# EasyEDA schematic SCH_webLed_2024-11-11.json
TITLE: Sheet_1; REV: 1.0; Date: 2024-10-29; Sheet: 1/1; Drawn By: crashtester19; Company: Your Company
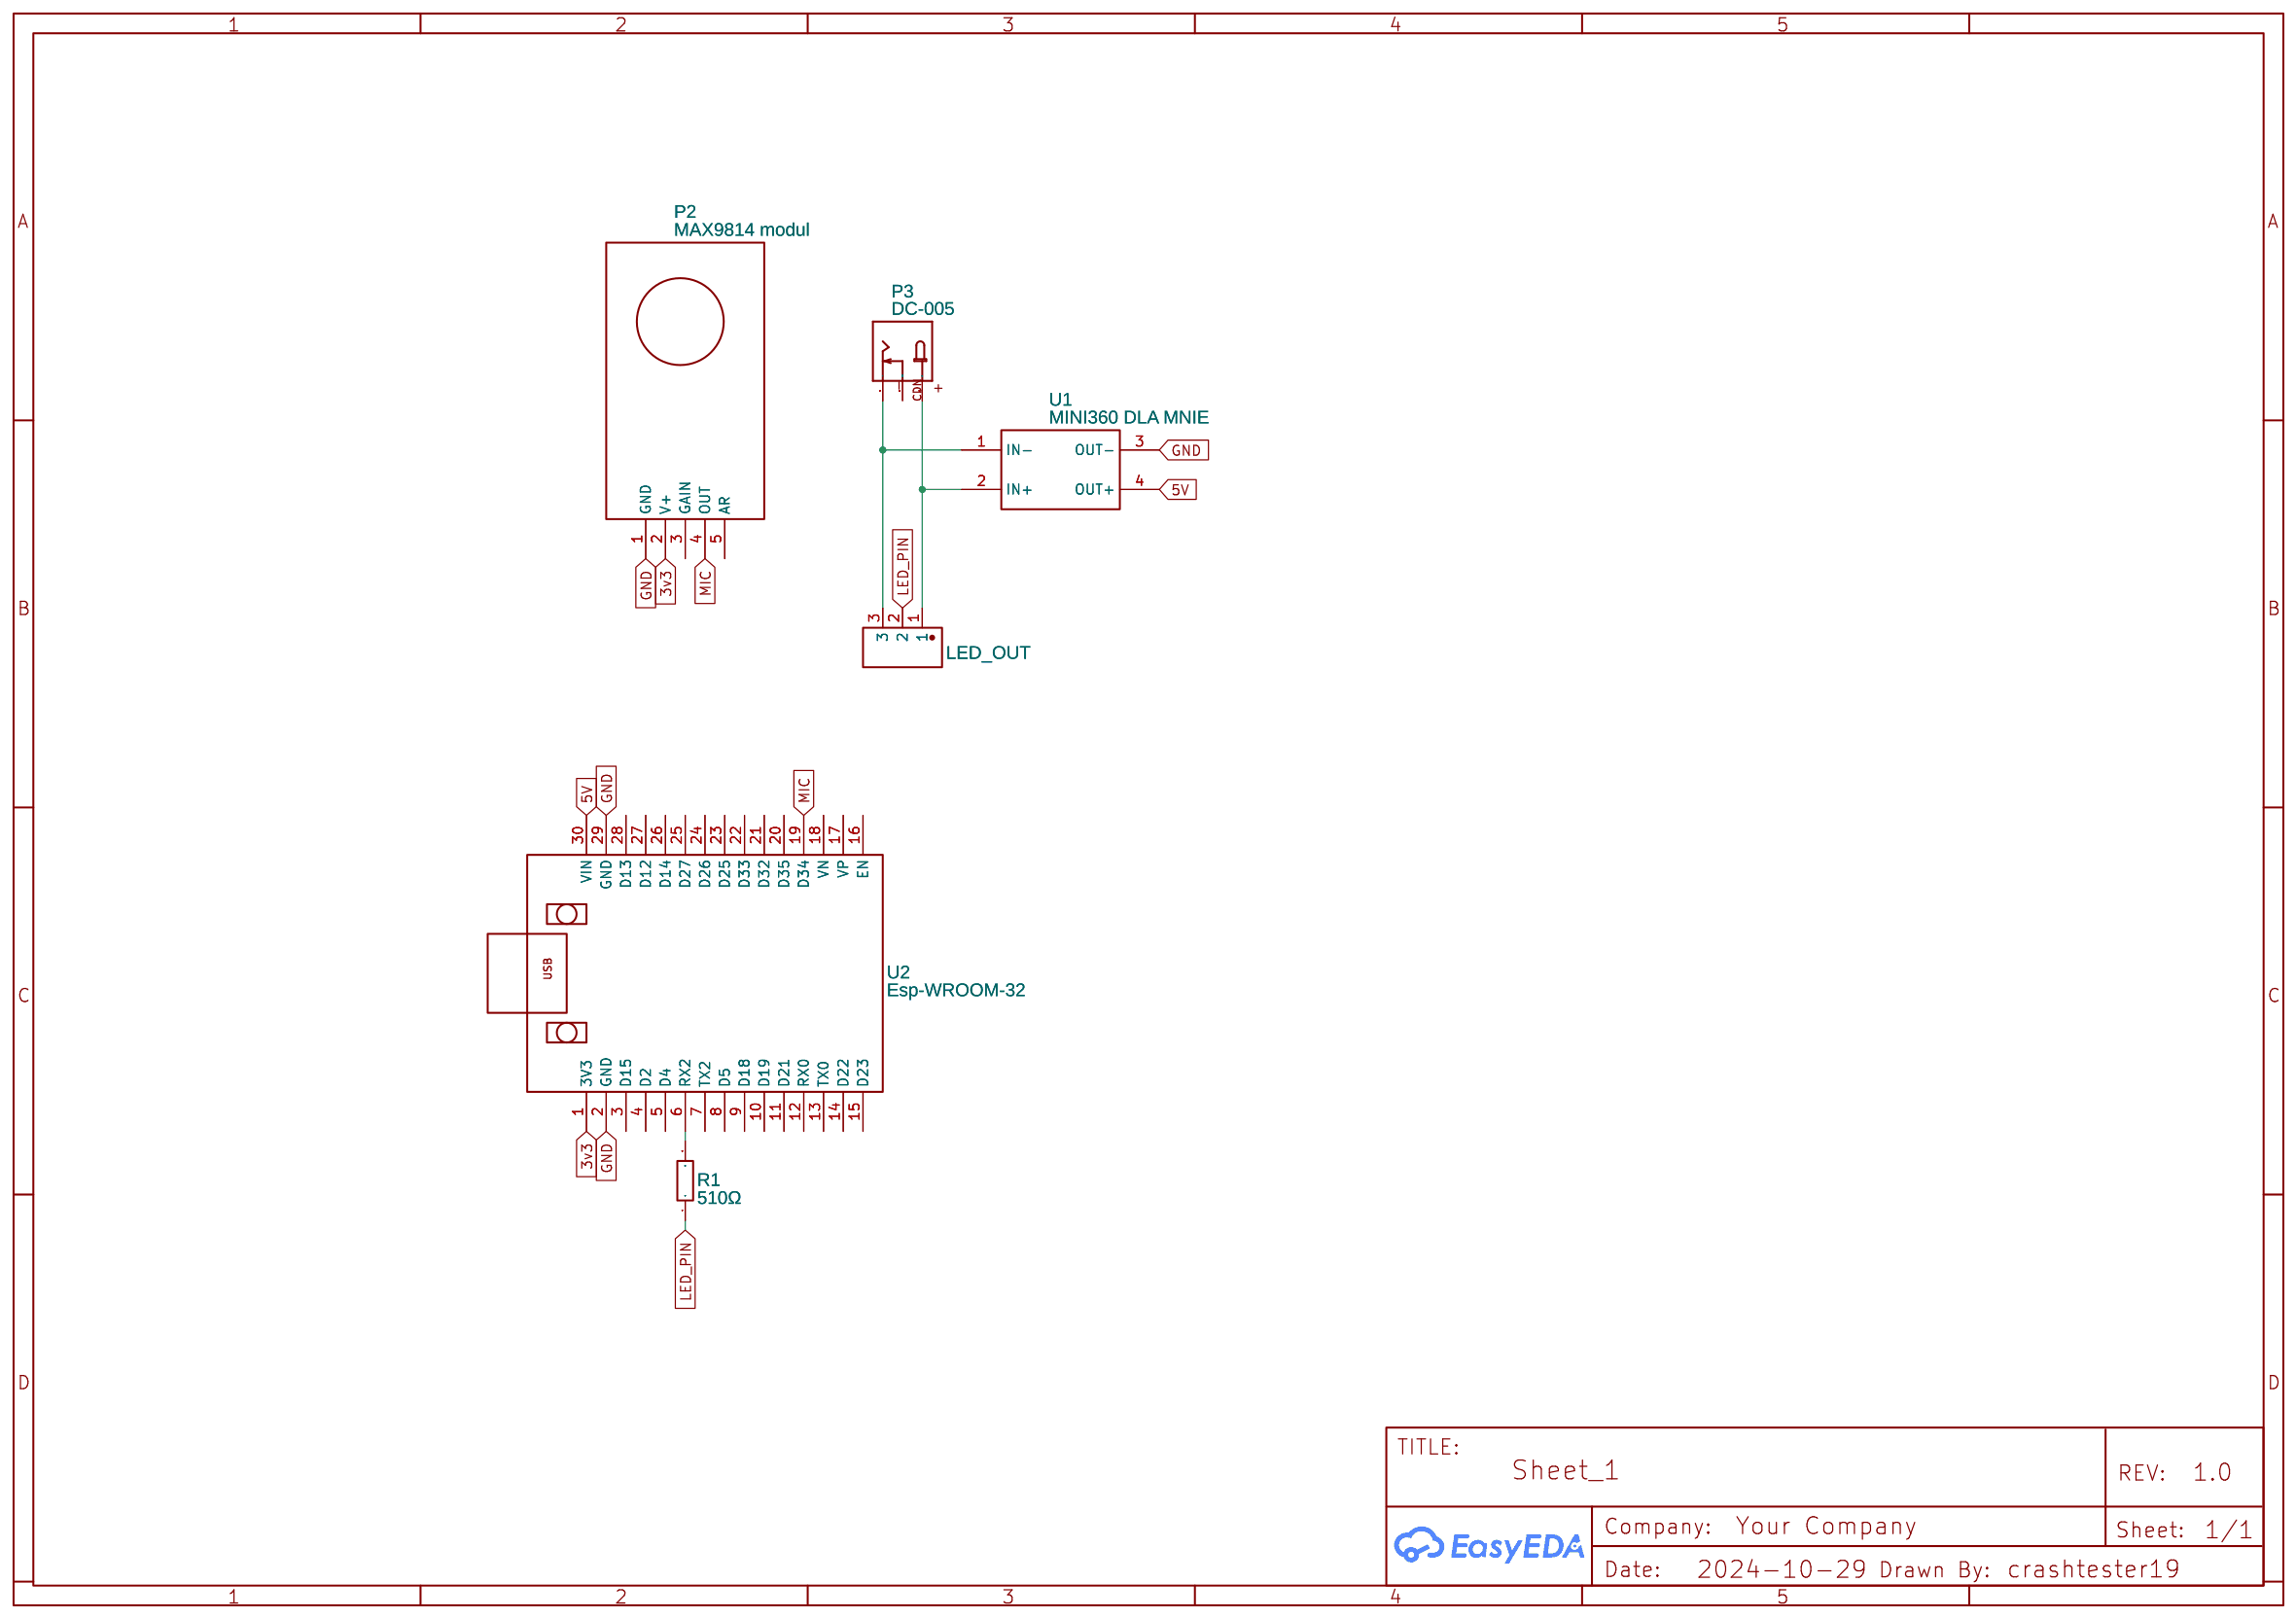
[diagram p0: schematic sheet]

## Parts
H2  LED_OUT  [HDR-TH_3P-P2.54-H-M-W10.4]
P2  MAX9814 modul  [MAX9814]
P3  DC-005  [DC-005]
R1  510Ω  [RES-TH_BD5.5-L15.0-P19.00-D0.8]
U1  MINI360 DLA MNIE  [MINI360BUCK]
U2  Esp-WROOM-32  [ESP32-WROOM-30-DEVBOARD]

## Library data of the parts
H2 = PZ254R-11-03P: Supplier: LCSC; Supplier Part: C492411; Manufacturer: XFCN; Contributor: LCSC; JLCPCB Part Class: Extended Part
P2 = MAX9814 modul: sourceId: 1T5FDZYC8; Contributor: pd1250
P3 = DC-005: CONN DC POWER JACK 2.1MM; Contributor: myskq
R1 = CF3WS-510Ω±5% T: Contributor: LCSC; Supplier: LCSC; Supplier Part: C120779; Manufacturer: CCO(千志电子); JLCPCB Part Class: Extended Part
U1 = MINI360BUCK_SMALL: Contributor: madhunm; sourceId: FRLFXR8qI; Manufacturer Part: Mini360; link: http://ali.pub/399f0z
U2 = Esp32-WROOM-30 Dev board: Contributor: jon.levin25

## Nets
3v3: P2.2(V+) U2.1(3V3)
5V: U1.4(OUT+) U2.30(VIN)
GND: P2.1(GND) U1.3(OUT-) U2.2(GND) U2.29(GND)
LED_PIN: H2.2 R1.1
MIC: P2.4(OUT) U2.19(D34)
Net-(H2-1): H2.1 P3.1(+) U1.2(IN+)
Net-(H2-3): H2.3 P3.2(-) U1.1(IN-)
Net-(R1-2): R1.2 U2.6(RX2)

Not connected (* = marked no-connect by the designer): P2 3(GAIN) 5(AR); P3 3(CDN); U2 3(D15) 4(D2) 5(D4) 7(TX2) 8(D5) 9(D18) 10(D19) 11(D21) 12(RX0) 13(TX0) 14(D22) 15(D23) 16(EN) 17(VP) 18(VN) 20(D35) 21(D32) 22(D33) 23(D25) 24(D26) 25(D27) 26(D14) 27(D12) 28(D13)
